# Altium schematic sheet axel_v1.schdoc
size 429 x 307 mm; Symbol: Sheet-Symbol_A4; Device: Sheet-Symbol_A4; @Project Name: Project Name; @Page Count: 3; @Update Date: 2021.11.05; @Create Date: 2024-10-22; @Schematic Name: Schematic Name; @Page No: 1; @Page Name: P1; Company: EasyEDA.com; Reviewed: EasyEDA; Version: V0.1; Page Size: A4; Part Number: JLCPCB-002; Drawn: EasyEDA; @Board Name: Board1; @Create Time: 00:31:28; @Update Time: 00:23:30; Width: 1655; Height: 1170; Region Start: 1; X Region Count: 6; Y Region Count: 4; Blade Width: 10; Title Block Position: 3
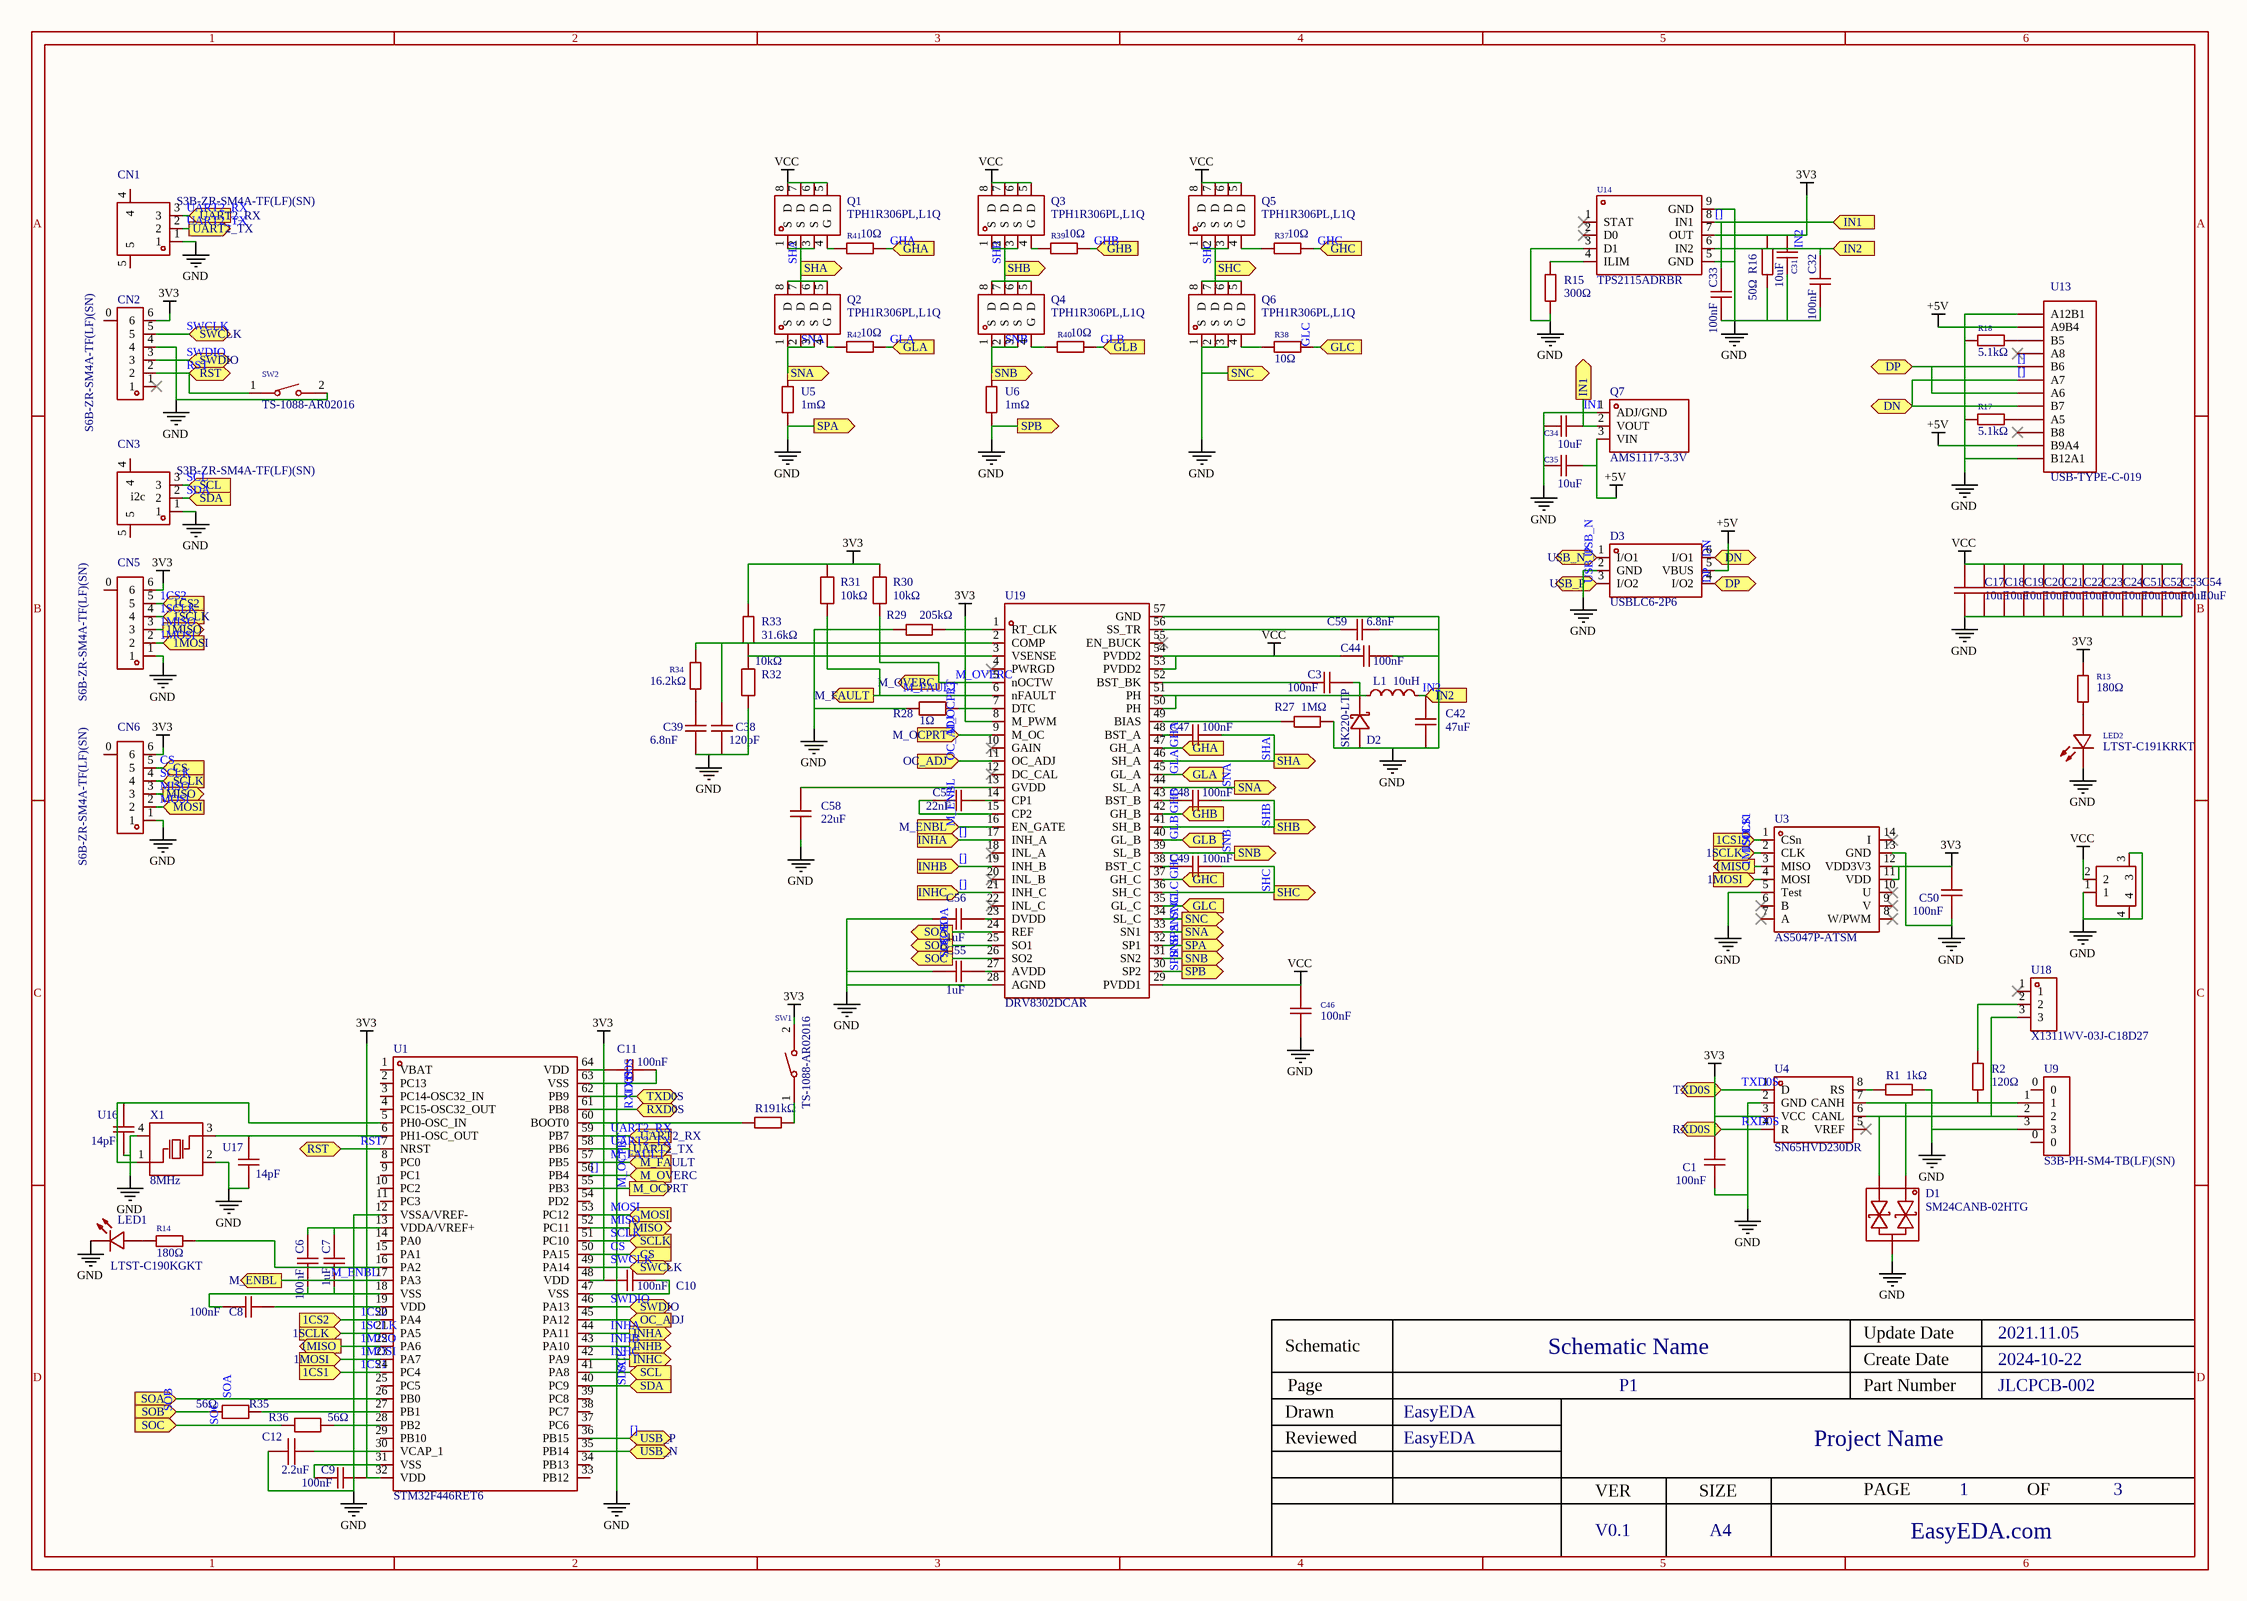
[diagram p0: axel_v1.schdoc]

## Parts
C1  100nF  [C0402]
C3  100nF  [C0402]
C6  100nF  [C0402]
C7  1uF  [C0402]
C8  100nF  [C0402]
C9  100nF  [C0402]
C10  100nF  [C0402]
C11  100nF  [C0402]
C12  2.2uF  [C0402]
C17  10uF  [C1210]
C18  10uF  [C1210]
C19  10uF  [C1210]
C20  10uF  [C1210]
C21  10uF  [C1210]
C22  10uF  [C1210]
C23  10uF  [C1210]
C24  10uF  [C1210]
C31  10uF  [C0402]
C32  100nF  [C0402]
C33  100nF  [C0402]
C34  10uF  [C0402]
C35  10uF  [C0402]
C38  120pF  [C0402]
C39  6.8nF  [C0402]
C42  47uF  [C1206]
C44  100nF  [C0603]
C46  100nF  [C0603]
C47  100nF  [C0402]
C48  100nF  [C0402]
C49  100nF  [C0402]
C50  100nF  [C0402]
C51  10uF  [C1210]
C52  10uF  [C1210]
C53  10uF  [C1210]
C54  10uF  [C1210]
C55  1uF  [C0402]
C56  1uF  [C0402]
C57  22nF  [C0402]
C58  22uF  [C0603]
C59  6.8nF  [C0402]
CN1  S3B-ZR-SM4A-TF(LF)(SN)  [CONN-TH_S3B-ZR-SM4A-TF-LF-SN]
CN2  S6B-ZR-SM4A-TF(LF)(SN)  [CONN-SMD_S6B-ZR-SM4A-TF]
CN3  S3B-ZR-SM4A-TF(LF)(SN)  [CONN-TH_S3B-ZR-SM4A-TF-LF-SN]
CN4  XT30PW-M  [CONN-TH_XT30PW-M]  (value not drawn)
CN5  S6B-ZR-SM4A-TF(LF)(SN)  [CONN-SMD_S6B-ZR-SM4A-TF]
CN6  S6B-ZR-SM4A-TF(LF)(SN)  [CONN-SMD_S6B-ZR-SM4A-TF]
D1  SM24CANB-02HTG  [SOT-23-3_L2.9-W1.3-P1.90-LS2.4-BR]
D2  SK220-LTP  [SMB_L4.6-W3.6-LS5.3-R-RD]
D3  USBLC6-2P6  [SOT-666-6_L1.6-W1.2-P0.50-LS1.6-BL]
L1  10uH  [IND-SMD_L5.2-W5.2_MCW-0530]
LED1  LTST-C190KGKT  [LED0603-RD]
LED2  LTST-C191KRKT  [LED0603-RD]
Q1  TPH1R306PL,L1Q  [POWERVDFN-8_L5.0-W5.0-P1.27-LS6.0-BL]
Q2  TPH1R306PL,L1Q  [POWERVDFN-8_L5.0-W5.0-P1.27-LS6.0-BL]
Q3  TPH1R306PL,L1Q  [POWERVDFN-8_L5.0-W5.0-P1.27-LS6.0-BL]
Q4  TPH1R306PL,L1Q  [POWERVDFN-8_L5.0-W5.0-P1.27-LS6.0-BL]
Q5  TPH1R306PL,L1Q  [POWERVDFN-8_L5.0-W5.0-P1.27-LS6.0-BL]
Q6  TPH1R306PL,L1Q  [POWERVDFN-8_L5.0-W5.0-P1.27-LS6.0-BL]
Q7  AMS1117-3.3V  [SOT-89-3_L4.5-W2.5-P1.50-LS4.2-BR]
R1  1kΩ  [R0402]
R2  120Ω  [R0402]
R13  180Ω  [R0402]
R14  180Ω  [R0402]
R15  300Ω  [R0402]
R16  50Ω  [R0402]
R17  5.1kΩ  [R0402]
R18  5.1kΩ  [R0402]
R19  1kΩ  [R0402]
R27  1MΩ  [R0402]
R28  1Ω  [R0402]
R29  205kΩ  [R0402]
R30  10kΩ  [R0402]
R31  10kΩ  [R0402]
R32  10kΩ  [R0402]
R33  31.6kΩ  [R0402]
R34  16.2kΩ  [R0402]
R35  56Ω  [R0402]
R36  56Ω  [R0402]
R37  10Ω  [R0402]
R38  10Ω  [R0402]
R39  10Ω  [R0402]
R40  10Ω  [R0402]
R41  10Ω  [R0402]
R42  10Ω  [R0402]
SW1  TS-1088-AR02016  [SW-SMD_L3.9-W3.0-P4.45]
SW2  TS-1088-AR02016  [SW-SMD_L3.9-W3.0-P4.45]
U1  STM32F446RET6  [LQFP-64_L10.0-W10.0-P0.50-LS12.0-BL]
U3  AS5047P-ATSM  [TSSOP-14_L5.0-W4.4-P0.65-LS6.4-BL]
U4  SN65HVD230DR  [SOIC-8_L4.9-W3.9-P1.27-LS6.0-BL]
U5  1mΩ  [R1210]
U6  1mΩ  [R1210]
U9  S3B-PH-SM4-TB(LF)(SN)  [CONN-SMD_S3B-PH-SM4-TB-LF-SN]
U13  USB-TYPE-C-019  [TYPE-C-SMD_HX-TYPE-C-16PIN]
U14  TPS2115ADRBR  [SON-8_L3.0-W3.0-P0.65-LS3.0-BL-EP]
U16  14pF  [C0402]
U17  14pF  [C0402]
U18  X1311WV-03J-C18D27  [HDR-TH_3P-P1.27-V-M]
U19  DRV8302DCAR  [HTSSOP-56_L14.0-W6.1-P0.50-LS8.1-BL-EP]
X1  8MHz  [OSC-SMD_4P-L3.2-W2.5-BL]

## Ports
1CS1 (in), 1CS2 (in), 1MISO (out), 1MOSI (in), 1SCLK (in), CS (in), DN (bidir), DP (bidir), GHA (in), GHB (in), GHC (in), GLA (in), GLB (in), GLC (in), IN1 (in), IN1 (out), IN2 (in), INHA (in), INHA (out), INHB (in), INHB (out), INHC (in), INHC (out), M_ENBL (in), M_ENBL (out), M_FAULT (in), M_FAULT (out), M_OCPRT (in), M_OCPRT (out), M_OVERC (in), M_OVERC (out), MISO (out), MOSI (in), OC_ADJ (in), RST (bidir), RXD0S (bidir), SCL (in), SCLK (in), SDA (in), SHA (out), SHB (out), SHC (out), SNA (out), SNB (out), SNC (out), SOA (in), SOA (out), SOB (in), SOB (out), SOC (in), SOC (out), SPA (out), SPB (out), SWCLK (bidir), SWDIO (bidir), TXD0S (bidir), UART2_RX (in), UART2_TX (out), USB_N (bidir), USB_P (bidir)

## Nets
3V3: C1.1 C6.2 C7.2 C8.2 C9.1 C10.2 C11.2 C31.2 C50.1 CN2.6 CN5.6 CN6.6 R13.2 R16.1 R30.2 R31.2 R33.2 SW1.2 U1.13(VDDA/VREF+) U1.19(VDD) U1.32(VDD) U1.48(VDD) U1.64(VDD) U3.11(VDD) U3.12(VDD3V3) U4.3(VCC) U14.7(OUT) U19.8(M_PWM)
+5V: C35.2 D3.5(VBUS) Q7.3(VIN) U13.A9B4 U13.B9A4
[]: C1.2 C6.1 C7.1 C8.1 C9.2 C10.1 C11.1 C12.1 C17.1 C18.1 C19.1 C20.1 C21.1 C22.1 C23.1 C24.1 C31.1 C32.1 C33.1 C33.2 C34.1 C34.2 C35.1 C38.2 C39.2 C42.1 C44.1 C46.2 C50.2 C51.1 C52.1 C53.1 C54.1 C55.1 C56.1 C58.2 C59.2 CN1.1 CN2.4 CN3.1 CN4.1 CN4.3 CN4.4 CN5.1 CN6.1 D1.3 D2.1(A) D3.2(GND) D3.3(I/O2) D3.4(I/O2) D3.6(I/O1) LED1.1(-) LED2.1(-) Q6.1(S) Q6.2(S) Q6.3(S) Q7.1(ADJ/GND) Q7.2(VOUT) R1.1 R15.1 R16.2 R17.1 R18.1 R27.2 R28.1 R29.1 R30.1 R32.1 SW2.2 U1.12(VSSA/VREF-) U1.18(VSS) U1.31(VSS) U1.36(PB15) U1.42(PA9) U1.43(PA10) U1.44(PA11) U1.47(VSS) U1.56(PB4) U1.63(VSS) U3.5(Test) U3.13(GND) U4.2(GND) U5.1 U6.1 U9.3 U13.A6 U13.A7 U13.A12B1 U13.B6 U13.B7 U13.B12A1 U14.3(D1) U14.5(GND) U14.8(IN1) U14.9(GND) U16.2 U17.2 U19.5(nOCTW) U19.17(INH_A) U19.19(INH_B) U19.21(INH_C) U19.28(AGND) U19.30(SP2) U19.32(SP1) U19.34(SL_C) U19.57(GND) X1.2(GND) X1.4(GND) ; port IN1, port DP, port DN, port USB_P, port INHA, port INHB, port INHC, port M_OVERC, port SPA, port SPB, port SNC  [also labelled DN, DP, GND, IN1, INHA, INHB, INHC, M_OVERC, SNC, SPA, SPB, USB_P]
VCC: C17.2 C18.2 C19.2 C20.2 C21.2 C22.2 C23.2 C24.2 C44.2 C46.1 C51.2 C52.2 C53.2 C54.2 CN4.2 Q1.5(D) Q1.6(D) Q1.7(D) Q1.8(D) Q3.5(D) Q3.6(D) Q3.7(D) Q3.8(D) Q5.5(D) Q5.6(D) Q5.7(D) Q5.8(D) U19.29(PVDD1) U19.53(PVDD2) U19.54(PVDD2)
1CS1: U1.24(PC4) U3.1(CSn) ; port 1CS1
1CS2: CN5.5 U1.20(PA4) ; port 1CS2
1MISO: CN5.3 U1.22(PA6) U3.3(MISO) ; port 1MISO
1MOSI: CN5.2 U1.23(PA7) U3.4(MOSI) ; port 1MOSI
1SCLK: CN5.4 U1.21(PA5) U3.2(CLK) ; port 1SCLK
CS: CN6.5 U1.50(PA15) ; port CS
GHA: R41.2 U19.47(GH_A) ; port GHA
GHB: R39.2 U19.42(GH_B) ; port GHB
GHC: R37.2 U19.37(GH_C) ; port GHC
GLA: R42.2 U19.45(GL_A) ; port GLA
GLB: R40.2 U19.40(GL_B) ; port GLB
GLC: R38.2 U19.35(GL_C) ; port GLC
IN2: C32.2 C42.2 L1.2 U14.6(IN2) ; port IN2
M_ENBL: U1.17(PA3) U19.16(EN_GATE) ; port M_ENBL
M_FAULT: R31.1 U1.57(PB5) U19.6(nFAULT) ; port M_FAULT
M_OCPRT: U1.55(PB3) U19.9(M_OC) ; port M_OCPRT
MISO: CN6.3 U1.52(PC11) ; port MISO
MOSI: CN6.2 U1.53(PC12) ; port MOSI
OC_ADJ: U1.45(PA12) U19.11(OC_ADJ) ; port OC_ADJ
RST: CN2.2 SW2.1 U1.7(NRST) ; port RST
RXD0S: U1.61(PB8) U4.4(R) ; port RXD0S
SCL: CN3.3 U1.41(PA8) ; port SCL
SCLK: CN6.4 U1.51(PC10) ; port SCLK
SDA: CN3.2 U1.40(PC9) ; port SDA
SHA: C47.1 Q1.1(S) Q1.2(S) Q1.3(S) Q2.5(D) Q2.6(D) Q2.7(D) Q2.8(D) U19.46(SH_A) ; port SHA
SHB: C48.1 Q3.1(S) Q3.2(S) Q3.3(S) Q4.5(D) Q4.6(D) Q4.7(D) Q4.8(D) U19.41(SH_B) ; port SHB
SHC: C49.1 Q5.1(S) Q5.2(S) Q5.3(S) Q6.5(D) Q6.6(D) Q6.7(D) Q6.8(D) U19.36(SH_C) ; port SHC
SNA: Q2.1(S) Q2.2(S) Q2.3(S) U5.2 U19.33(SN1) U19.44(SL_A) ; port SNA
SNB: Q4.1(S) Q4.2(S) Q4.3(S) U6.2 U19.31(SN2) U19.39(SL_B) ; port SNB
SOA: U1.26(PB0) U19.24(REF) ; port SOA
SOB: R35.1 U19.25(SO1) ; port SOB
SOC: R36.1 U19.26(SO2) ; port SOC
SWCLK: CN2.5 U1.49(PA14) ; port SWCLK
SWDIO: CN2.3 U1.46(PA13) ; port SWDIO
TXD0S: U1.62(PB9) U4.1(D) ; port TXD0S
UART2_RX: CN1.3 U1.59(PB7) ; port UART2_RX
UART2_TX: CN1.2 U1.58(PB6) ; port UART2_TX
USB_N: D3.1(I/O1) U1.35(PB14) ; port USB_N
NetC3_1: C3.1 U19.52(BST_BK)
NetC3_2: C3.2 D2.2(K) L1.1 U19.50(PH) U19.51(PH)
NetC12_2: C12.2 U1.30(VCAP_1)
NetC38_1: C38.1 R34.2 U19.2(COMP)
NetC39_1: C39.1 R34.1
NetC47_2: C47.2 U19.48(BST_A)
NetC48_2: C48.2 U19.43(BST_B)
NetC49_2: C49.2 U19.38(BST_C)
NetC55_2: C55.2 U19.27(AVDD)
NetC56_2: C56.2 U19.23(DVDD)
NetC57_1: C57.1 U19.14(CP1)
NetC57_2: C57.2 U19.15(CP2)
NetC58_1: C58.1 U19.13(GVDD)
NetC59_1: C59.1 U19.56(SS_TR)
NetD1_1: D1.1 R2.2 U4.7(CANH) U9.1
NetD1_2: D1.2 U4.6(CANL) U9.2 U18.3
NetLED1_2: LED1.2(+) R14.1
NetLED2_2: LED2.2(+) R13.1
NetQ1_4: Q1.4(G) R41.1
NetQ2_4: Q2.4(G) R42.1
NetQ3_4: Q3.4(G) R39.1
NetQ4_4: Q4.4(G) R40.1
NetQ5_4: Q5.4(G) R37.1
NetQ6_4: Q6.4(G) R38.1
NetR1_2: R1.2 U4.8(RS)
NetR2_1: R2.1 U18.2
NetR14_2: R14.2 U1.16(PA2)
NetR15_2: R15.2 U14.4(ILIM)
NetR17_2: R17.2 U13.A5
NetR18_2: R18.2 U13.B5
NetR19_1: R19.1 SW1.1
NetR19_2: R19.2 U1.60(BOOT0)
NetR27_1: R27.1 U19.49(BIAS)
NetR28_2: R28.2 U19.7(DTC)
NetR29_2: R29.2 U19.1(RT_CLK)
NetR32_2: R32.2 R33.1 U19.3(VSENSE)
NetR35_2: R35.2 U1.27(PB1)
NetR36_2: R36.2 U1.28(PB2)
NetU1_5: U1.5(PH0-OSC_IN) U16.1 X1.1(OSC1)
NetU1_6: U1.6(PH1-OSC_OUT) U17.1 X1.3(OSC2)

Not connected (* = marked no-connect by the designer): CN1 4 5; CN2 0 1*; CN3 4 5; CN5 0; CN6 0; U1 1(VBAT) 2(PC13) 3(PC14-OSC32_IN) 4(PC15-OSC32_OUT) 8(PC0) 9(PC1) 10(PC2) 11(PC3) 14(PA0) 15(PA1) 25(PC5) 29(PB10) 33(PB12) 34(PB13) 37(PC6) 38(PC7) 39(PC8) 54(PD2); U3 6(B)* 7(A)* 8(W/PWM)* 9(V)* 10(U)* 14(I)*; U4 5(VREF)*; U9 0; U13 A8* B8*; U14 1(STAT)* 2(D0)*; U18 1*; U19 4(PWRGD)* 10(GAIN)* 12(DC_CAL)* 18(INL_A)* 20(INL_B)* 22(INL_C)* 55(EN_BUCK)*

## Notes on the sheet
- (near CN3) i2c
- 1
- 2
- 3
- 4
- 5
- 6
- A
- B
- C
- Schematic
- Schematic Name
- Create Date
- Update Date
- 2021.11.05
- 2024-10-22
- D
- Drawn
- Page
- EasyEDA
- P1
- Part Number
- JLCPCB-002
- Reviewed
- VER
- SIZE
- PAGE
- Project Name
- OF
- V0.1
- A4
- EasyEDA.com

## Library data of the parts
C1 C3 C6 C8-C11 C32 C33 C47-C50 = 0402B104K250NT: Manufacturer: FH(风华); Symbol: CAP; Add into BOM: yes; Tolerance: ±10%; Check: true; Device: 0402B104K250NT; LCSC Part Name: 100nF ±10% 25V; Supplier Part: C56392; Manufacturer Part: 0402B104K250NT; Supplier Footprint: 0402; JLCPCB Part Class: Extended Part; Datasheet: https://atta.szlcsc.com/upload/public/pdf/source/20200305/C486355_26A10D38EF8C2A5C37091D0039909270.pdf; Supplier: LCSC; Convert to PCB: yes; Value: 100nF
C7 = TCC0402X5R105K160AT: Manufacturer: CCTC(三环); Symbol: TCC0402X5R105M6R3AT; Add into BOM: yes; Tolerance: ±10%; Check: true; Device: TCC0402X5R105K160AT; LCSC Part Name: 1uF ±10% 16V; Supplier Part: C5142580; Manufacturer Part: TCC0402X5R105K160AT; Supplier Footprint: 0402; JLCPCB Part Class: Extended Part; Datasheet: https://atta.szlcsc.com/upload/public/pdf/source/20220901/C7FE60C0D46A5253B97B3A98D5175D30.pdf; Supplier: LCSC; Convert to PCB: yes; Value: 1uF
C12 = CL05A225MQ5NSNC: Manufacturer: SAMSUNG(三星); Add into BOM: yes; Tolerance: ±20%; Check: true; Symbol: CL05A225MQ5NSNC; Device: CL05A225MQ5NSNC; LCSC Part Name: 2.2uF ±20% 6.3V; Supplier Part: C12530; Manufacturer Part: CL05A225MQ5NSNC; Supplier Footprint: 0402; JLCPCB Part Class: Basic Part; Datasheet: https://atta.szlcsc.com/upload/public/pdf/source/20160218/1457707763339.pdf; Supplier: LCSC; Convert to PCB: yes; Value: 2.2uF
C17-C24 C51-C54 = GRM32EC72A106KE05L: Manufacturer: muRata(村田); Add into BOM: yes; Tolerance: ±10%; Check: true; Symbol: GRM32EC72A106KE05L; Device: GRM32EC72A106KE05L; LCSC Part Name: 10uF ±10% 100V; Supplier Part: C576517; Manufacturer Part: GRM32EC72A106KE05L; Supplier Footprint: 1210; JLCPCB Part Class: Extended Part; Datasheet: https://atta.szlcsc.com/upload/public/pdf/source/20200716/C162505_CE68ED646330179BB59D1BEC6A5D09D7.pdf; Supplier: LCSC; Convert to PCB: yes; Value: 10uF
C31 C34 C35 = CL05A106MQ5NUNC: Manufacturer: SAMSUNG(三星); Add into BOM: yes; Tolerance: ±20%; Check: true; Symbol: CL05A106MQ5NUNC; Device: CL05A106MQ5NUNC; Supplier: LCSC; Manufacturer Part: CL05A106MQ5NUNC; Value: 10uF; Supplier Part: C15525; JLCPCB Part Class: Basic Part; LCSC Part Name: 10uF ±20% 6.3V; Supplier Footprint: 0402; Datasheet: https://atta.szlcsc.com/upload/public/pdf/source/20220823/2B02EE04F8F211D38A52DCB16EB6BEBA.pdf; Convert to PCB: yes
C38 = CC0402JRNPO9BN121: Manufacturer: YAGEO(国巨); Symbol: CAP; Add into BOM: yes; Tolerance: ±5%; Check: true; Device: CC0402JRNPO9BN121; LCSC Part Name: 120pF ±5% 50V; Supplier Part: C106996; Manufacturer Part: CC0402JRNPO9BN121; Supplier Footprint: 0402; JLCPCB Part Class: Extended Part; Datasheet: https://atta.szlcsc.com/upload/public/pdf/source/20170914/C128857_1505359892143968080.pdf; Supplier: LCSC; Convert to PCB: yes; Value: 120pF
C39 = CC0402KRX7R9BB682: Manufacturer: YAGEO(国巨); Symbol: CAP; Add into BOM: yes; Tolerance: ±10%; Check: true; Device: CC0402KRX7R9BB682; LCSC Part Name: 6.8nF ±10% 50V; Supplier Part: C93654; Manufacturer Part: CC0402KRX7R9BB682; Supplier Footprint: 0402; JLCPCB Part Class: Extended Part; Datasheet: https://atta.szlcsc.com/upload/public/pdf/source/20181008/C309510_22F155564471FAF6A489F7D68F34234E.pdf; Supplier: LCSC; Convert to PCB: yes; Value: 6.8nF
C42 = GRM31CR61A476ME15L: Manufacturer: muRata(村田); Add into BOM: yes; Tolerance: ±20%; Symbol: GRM31CR61A476ME15L; Device: GRM31CR61A476ME15L; LCSC Part Name: 47uF ±20% 10V; Supplier Part: C94034; Manufacturer Part: GRM31CR61A476ME15L; Supplier Footprint: 1206; JLCPCB Part Class: Extended Part; Datasheet: https://atta.szlcsc.com/upload/public/pdf/source/20170310/1489116302849.pdf; Supplier: LCSC; Convert to PCB: yes; Value: 47uF
C44 C46 = TCC0603X7R104K101CT: Manufacturer: CCTC(三环); Add into BOM: yes; Tolerance: ±10%; Symbol: TCC0603X7R104K101CT; Device: TCC0603X7R104K101CT; Supplier: LCSC; Supplier Part: C696916; Manufacturer Part: TCC0603X7R104K101CT; Value: 100nF; JLCPCB Part Class: Extended Part; LCSC Part Name: 100nF ±10% 100V; Supplier Footprint: 0603; Datasheet: https://atta.szlcsc.com/upload/public/pdf/source/20200707/C696841_89A2C111301AB76AE7642008585E7A11.pdf; Convert to PCB: yes
C55 C56 = TCC0402X5R105K160AT: Manufacturer: CCTC(三环); Add into BOM: yes; Tolerance: ±10%; Symbol: TCC0402X5R105K160AT; Device: TCC0402X5R105K160AT; LCSC Part Name: 1uF ±10% 16V; Supplier Part: C5142580; Manufacturer Part: TCC0402X5R105K160AT; Supplier Footprint: 0402; JLCPCB Part Class: Extended Part; Datasheet: https://atta.szlcsc.com/upload/public/pdf/source/20220901/C7FE60C0D46A5253B97B3A98D5175D30.pdf; Supplier: LCSC; Convert to PCB: yes; Value: 1uF
C57 = TCC0402X7R223K500AT: Manufacturer: CCTC(三环); Add into BOM: yes; Tolerance: ±10%; Symbol: TCC0402X7R223K500AT; Device: TCC0402X7R223K500AT; LCSC Part Name: 22nF ±10% 50V; Supplier Part: C380305; Manufacturer Part: TCC0402X7R223K500AT; Supplier Footprint: 0402; JLCPCB Part Class: Extended Part; Datasheet: https://atta.szlcsc.com/upload/public/pdf/source/20191203/C466239_F62A586702D44EEA1C39B32FC8662B21.pdf; Supplier: LCSC; Convert to PCB: yes; Value: 22nF
C58 = CL10A226MO7JZNC: Manufacturer: SAMSUNG(三星); Add into BOM: yes; Tolerance: ±20%; Symbol: CL10A226MO7JZNC; Device: CL10A226MO7JZNC; LCSC Part Name: 22uF ±20% 16V; Supplier Part: C2762594; Manufacturer Part: CL10A226MO7JZNC; Supplier Footprint: 0603; JLCPCB Part Class: Extended Part; Datasheet: https://atta.szlcsc.com/upload/public/pdf/source/20220811/0832C3B1C642040B023B7A6186895861.pdf; Supplier: LCSC; Convert to PCB: yes; Value: 22uF
C59 = CC0402KRX7R9BB682: Manufacturer: YAGEO(国巨); Symbol: 0402B682K500NT; Add into BOM: yes; Tolerance: ±10%; Device: CC0402KRX7R9BB682; LCSC Part Name: 6.8nF ±10% 50V; Supplier Part: C93654; Manufacturer Part: CC0402KRX7R9BB682; Supplier Footprint: 0402; JLCPCB Part Class: Extended Part; Datasheet: https://atta.szlcsc.com/upload/public/pdf/source/20181008/C309510_22F155564471FAF6A489F7D68F34234E.pdf; Supplier: LCSC; Convert to PCB: yes; Value: 6.8nF
CN1 CN3 = S3B-ZR-SM4A-TF(LF)(SN): Manufacturer: JST; Add into BOM: yes; Pins Structure: 1x3P; Pitch: 1.5mm; Reference Series: ZH; Number of PINs Per Row: 3; Current Rating (Max): 1A; Rated Voltage (Max): 50V; Plastic Material: PA6T; Flame Retardant Rating: UL94V-0; Supplementary Features: 辅助焊脚; Z-Height of the Board: 3.7mm; X-Length of Bottom Edge on Board (Spacing Line): 7.5mm; Y-Width of Bottom Edge on Board: 6.5mm; Check: true; Symbol: S3B-ZR-SM4A-TF(LF)(SN); Device: S3B-ZR-SM4A-TF(LF)(SN); LCSC Part Name: 1x3P 间距:1.5mm 卧贴 系列:ZH; Supplier Part: C72591; Manufacturer Part: S3B-ZR-SM4A-TF(LF)(SN); Supplier Footprint: SMD,P=1.5mm,卧贴; JLCPCB Part Class: Extended Part; Datasheet: https://atta.szlcsc.com/upload/public/pdf/source/20181010/C265435_265A0E364DE7AFA8D888C9DA34FBB2A6.pdf; Supplier: LCSC; Convert to PCB: yes; Mounting Style: 卧贴; Number of Pins: 3P; Number of Rows: 1; Row Spacing: -; Contact Material: Brass; Contact Plating: Tin; Operating Temperature Range: -25℃~+85℃; Colour: White
CN2 CN5 CN6 = S6B-ZR-SM4A-TF(LF)(SN): Manufacturer: JST; Add into BOM: yes; Pins Structure: 1x6P; Pitch: 1.5mm; Reference Series: ZH; Number of PINs Per Row: 6; Current Rating (Max): 1A; Rated Voltage (Max): 50V; Plastic Material: PA6T; Flame Retardant Rating: UL94V-0; Supplementary Features: Auxiliary soldering legs; Z-Height of the Board: 3.7mm; X-Length of Bottom Edge on Board (Spacing Line): 12mm; Y-Width of Bottom Edge on Board: 6.5mm; Check: true; Symbol: S6B-ZR-SM4A-TF(LF)(SN); Device: S6B-ZR-SM4A-TF(LF)(SN); LCSC Part Name: 1x6P 间距:1.5mm 卧贴 系列:ZH; Supplier Part: C265070; Manufacturer Part: S6B-ZR-SM4A-TF(LF)(SN); Supplier Footprint: SMD,P=1.5mm,卧贴; JLCPCB Part Class: Extended Part; Datasheet: https://atta.szlcsc.com/upload/public/pdf/source/20181114/C265070_E4B41040DCBDC845CB582ECD7CD45308.pdf; Supplier: LCSC; Convert to PCB: yes; Mounting Style: Horizontal attachment; Number of Pins: 6P; Number of Rows: 1; Row Spacing: -; Contact Material: Brass; Contact Plating: Tin; Operating Temperature Range: -25℃~+85℃; Colour: White
CN4 = XT30PW-M: Manufacturer: AMASS(艾迈斯); Add into BOM: yes; Brand: 艾迈斯; RatedVoltage: DC 500V; InterfaceType: 公头; RatedCurrent: 15A; RecommendedWireGauge: 16/18/20AWG; contact resistance: 1.2mΩ; specifications: 2pin; Check: true; Symbol: XT30PW-M; Device: XT30PW-M; Supplier: LCSC; Supplier Part: C431092; Manufacturer Part: XT30PW-M; JLCPCB Part Class: Extended Part; LCSC Part Name: AMASS(艾迈斯)航模插头 卧式弯脚 XT30PW-M公头; Supplier Footprint: -; Datasheet: https://atta.szlcsc.com/upload/public/pdf/source/20220222/6A9F22F7850E25B33E1BE430ADF8560B.pdf; Convert to PCB: yes; Model: XT30PW-M; Power: -; Output: -; Input: -; Size: -; Interface: -; Type: 航模插头; Colour: -; MaximumCurrent: -; Type1: -; NumberOfUSBHoles: -; MetalMaterial: -; InsulationMaterial: -; FlameRetardantGrade: -; Belt length: -
D1 = SM24CANB-02HTG: Manufacturer: Littelfuse(美国力特); Add into BOM: yes; Reverse Stand-Off Voltage (Vrwm): 24V@Max; Maximum Clamping Voltage: 50V; Peak Pulse Current (Ipp)@10/1000us: 10A@8/20us; Peak Pulse Power Dissipation (Ppp)@10/1000us: 500W; Breakdown Voltage: 26.7V; Type: TVS; Check: true; Symbol: SM24CANB-02HTG; Device: SM24CANB-02HTG; LCSC Part Name: SM24CANB-02HTG; Supplier Part: C151237; Manufacturer Part: SM24CANB-02HTG; Supplier Footprint: SOT-23; JLCPCB Part Class: Extended Part; Datasheet: https://atta.szlcsc.com/upload/public/pdf/source/20171201/C151237_15121179073421156494.pdf; Supplier: LCSC; Convert to PCB: yes
D2 = SK220-LTP: Manufacturer: MCC(美微科); Add into BOM: yes; Forward Voltage (Vf@If): 900mV@2A; Reverse Voltage (Vr): 200V; Average Rectified Current (Io): 2A; Reverse Leakage Current (Ir): 10uA@200V; Check: true; Symbol: SK220-LTP; Device: SK220-LTP; LCSC Part Name: 电压:200V 电流:2A; Supplier Part: C725397; Manufacturer Part: SK220-LTP; Supplier Footprint: DO-214AA(SMB); JLCPCB Part Class: Extended Part; Datasheet: https://atta.szlcsc.com/upload/public/pdf/source/20200618/C669011_F1CEF0D3BD7CC1B5AE107AF481F299E1.pdf; Supplier: LCSC; Convert to PCB: yes; Diode Configuration: -
D3 = USBLC6-2P6: Manufacturer: TECH PUBLIC(台舟); Symbol: USBLC6-2P6_C2827693; Add into BOM: yes; polarity: Unidirectional; Reverse Stand-Off Voltage (Vrwm): 5V; Maximum Clamping Voltage: 14V; Peak Pulse Current (Ipp): 5.5A; Peak Pulse Power Dissipation (Ppp): 80W; Breakdown Voltage: 6V; Reverse Leakage Current (Ir): 80nA; Number of Lines: Dual channel; level of protection: IEC 61000-4-2; Type: ESD; Check: true; Device: USBLC6-2P6; LCSC Part Name: MSL=3; Supplier Part: C2827693; Manufacturer Part: USBLC6-2P6; Supplier Footprint: SOT-666-6; JLCPCB Part Class: Extended Part; Datasheet: https://atta.szlcsc.com/upload/public/pdf/source/20210810/36353A9194EA9F4E33F8AE18BE051AEA.pdf; Supplier: LCSC; Convert to PCB: yes; Operating Temperature: -55℃~+125℃
L1 = SMMS0530-100M: Manufacturer: SXN(顺翔诺); Add into BOM: yes; Tolerance: ±20%; Saturation Current (Isat): 3.5A; Type: 一体成型电感; Symbol: SMMS0530-100M; Device: SMMS0530-100M; Supplier: LCSC; Supplier Part: C181721; Manufacturer Part: SMMS0530-100M; Value: 10uH; JLCPCB Part Class: Extended Part; LCSC Part Name: 10uH ±20% 3.5A; Supplier Footprint: SMD; Datasheet: https://atta.szlcsc.com/upload/public/pdf/source/20210810/BBF24330FB2F5029F637830BA9C42C0D.pdf; Convert to PCB: yes
LED1 = LTST-C190KGKT: Manufacturer: LITEON(光宝); Add into BOM: yes; Emitted Color: Green-yellow; Forward Voltage (VF): 2V; Power Dissipation: 75mW; Forward Current: 20mA; Dominant Wavelength: 567.5nm~576.5nm; Peak Wavelength: 574nm; Lens Color: 无色透明透镜; Luminous Intensity: 35mcd; Viewing Angle: 130°; Check: true; Symbol: LTST-C190KGKT; Device: LTST-C190KGKT; LCSC Part Name: 普绿/黄绿; Supplier Part: C125094; Manufacturer Part: LTST-C190KGKT; Supplier Footprint: 0603; JLCPCB Part Class: Extended Part; Datasheet: https://atta.szlcsc.com/upload/public/pdf/source/20180129/C125094_15171883203831315957.pdf; Supplier: LCSC; Convert to PCB: yes; Diode Configuration: -; Color Temperature: -; Mounting Sytle: -; Operating Temperature: -30℃~+85℃
LED2 = LTST-C191KRKT: Manufacturer: LITEON(光宝); Add into BOM: yes; Emitted Color: Red; Forward Voltage (VF): 2V; Power Dissipation: 75mW; Forward Current: 20mA; Dominant Wavelength: 631nm; Peak Wavelength: 639nm; Lens Color: 无色透明透镜; Luminous Intensity: 54mcd; Viewing Angle: 130°; Check: true; Symbol: LTST-C191KRKT; Device: LTST-C191KRKT; Supplier: LCSC; Manufacturer Part: LTST-C191KRKT; Supplier Part: C125099; JLCPCB Part Class: Extended Part; LCSC Part Name: 红灯; Supplier Footprint: 0603; Datasheet: https://atta.szlcsc.com/upload/public/pdf/source/20180129/C125099_15171878294931315872.pdf; Convert to PCB: yes; Diode Configuration: -; Color Temperature: -; Mounting Sytle: -; Operating Temperature: -55℃~+85℃
Q1-Q6 = TPH1R306PL,L1Q: Manufacturer: TOSHIBA(东芝); Add into BOM: yes; Type: 1个NChannel; Drain Source Voltage (Vdss): 60V; Power Dissipation (Pd): ；; Drain Source On Resistance (RDS(on)@Vgs,Id): 1.34mΩ@50A,10V; Gate Threshold Voltage (Vgs(th)@Id): 2.5V@1mA; Total Gate Charge (Qg@Vgs): 91nC@10V; Input Capacitance (Ciss@Vds): 8.1nF@30V; Check: true; Symbol: TPH1R306PL,L1Q; Device: TPH1R306PL,L1Q; LCSC Part Name: 1个N沟道 耐压:60V 电流:100A; Supplier Part: C516182; Manufacturer Part: TPH1R306PL,L1Q; Supplier Footprint: SOP-8; JLCPCB Part Class: Extended Part; Datasheet: https://atta.szlcsc.com/upload/public/pdf/source/20200417/C516182_3FBE290F0BA589EB2B5C14910E09ED65.pdf; Supplier: LCSC; Convert to PCB: yes; Reverse Transfer Capacitance (Crss@Vds): -
Q7 = AMS1117-3.3V_C5120796: Manufacturer: MSKSEMI(美森科); Add into BOM: yes; Maximum Input Voltage: 18V; Output Voltage: 3.3V; MAX Output Current: 1A; Dropout Voltage: 1.4V@(1A); standby current: 12mA; Output Polarity: Positive electrode; Number of Outputs: 1; Symbol: AMS1117-3.3V_C5120796; Device: AMS1117-3.3V_C5120796; LCSC Part Name: 输入18V 输出3.3V 1A; Supplier Part: C5120796; Manufacturer Part: AMS1117-3.3V; Supplier Footprint: SOT-89; JLCPCB Part Class: Extended Part; Datasheet: https://atta.szlcsc.com/upload/public/pdf/source/20220727/5E62EAC46FFFF83337622C0FBE1B6BF8.pdf; Supplier: LCSC; Convert to PCB: yes; Operating Temperature: 0℃~+125℃
R1 R19 = RT0402BRD071KL: Manufacturer: YAGEO(国巨); Symbol: Res; Add into BOM: yes; Tolerance: ±0.1%; Temperature Coefficient: ±25ppm/℃; Check: true; Device: RT0402BRD071KL; LCSC Part Name: 薄膜电阻 1kΩ ±0.1% 62.5mW; Supplier Part: C852624; Manufacturer Part: RT0402BRD071KL; Supplier Footprint: 0402; JLCPCB Part Class: Extended Part; Datasheet: https://atta.szlcsc.com/upload/public/pdf/source/20210609/C852624_9EB141A274604F87C6BB037C8019D50A.pdf; Supplier: LCSC; Convert to PCB: yes; Type: Thin Film Resistor; Value: 1kΩ; Operating Temperature Range: -55℃~+155℃
R2 = RN73H1ETTP1200B25: Manufacturer: KOA; Symbol: Res; Add into BOM: yes; Tolerance: ±0.1%; Temperature Coefficient: ±25ppm/℃; Check: true; Device: RN73H1ETTP1200B25; LCSC Part Name: 金属膜电阻 120Ω ±0.1% 62.5mW; Supplier Part: C186115; Manufacturer Part: RN73H1ETTP1200B25; Supplier Footprint: 0402; JLCPCB Part Class: Extended Part; Datasheet: https://atta.szlcsc.com/upload/public/pdf/source/20180504/C186301_C27E1BE5F8243F699B52B606AD6FD604.pdf; Supplier: LCSC; Convert to PCB: yes; Type: Metal Film Resistors; Value: 120Ω; Operating Temperature Range: -55℃~+155℃
R13 R14 = 0402WGF1800TCE: Manufacturer: UNI-ROYAL(厚声); Add into BOM: yes; Tolerance: ±1%; Temperature Coefficient: ±100ppm/℃; Check: true; Symbol: 0402WGF1800TCE; Device: 0402WGF1800TCE; Supplier: LCSC; Manufacturer Part: 0402WGF1800TCE; Supplier Part: C38941; Value: 180Ω; JLCPCB Part Class: Extended Part; LCSC Part Name: 180Ω ±1% 62.5mW 厚膜电阻; Supplier Footprint: 0402; Datasheet: https://atta.szlcsc.com/upload/public/pdf/source/20200306/C422600_1E6D84923E4A46A82E41ADD87F860B5C.pdf; Convert to PCB: yes; Type: Thick Film Resistors; Operating Temperature Range: -55℃~+155℃
R15 = RC0402FR-07300RL: Manufacturer: YAGEO(国巨); Add into BOM: yes; Tolerance: ±1%; Temperature Coefficient: ±100ppm/℃; Check: true; Symbol: RC0402FR-07300RL; Device: RC0402FR-07300RL; LCSC Part Name: 厚膜电阻 300Ω ±1% 62.5mW; Supplier Part: C138010; Manufacturer Part: RC0402FR-07300RL; Supplier Footprint: 0402; JLCPCB Part Class: Extended Part; Datasheet: https://atta.szlcsc.com/upload/public/pdf/source/20181009/C309620_DA5935B6E1D48212CB7A533FE518B3C2.pdf; Supplier: LCSC; Convert to PCB: yes; Type: Thick Film Resistors; Value: 300Ω; Operating Temperature Range: -55℃~+155℃
R16 = RT0402BRE0750RL: Manufacturer: YAGEO(国巨); Add into BOM: yes; Tolerance: ±0.1%; Temperature Coefficient: ±50ppm/℃; Check: true; Symbol: RT0402BRE0750RL; Device: RT0402BRE0750RL; LCSC Part Name: 薄膜电阻 50Ω ±0.1% 62.5mW; Supplier Part: C853312; Manufacturer Part: RT0402BRE0750RL; Supplier Footprint: 0402; JLCPCB Part Class: Extended Part; Datasheet: https://atta.szlcsc.com/upload/public/pdf/source/20200610/C326738_5639A9F1B6EB6E4AE2197577D3456E7F.pdf; Supplier: LCSC; Convert to PCB: yes; Type: Thin Film Resistor; Value: 50Ω; Operating Temperature Range: -55℃~+155℃
R17 R18 = 0402WGF5101TCE: Manufacturer: UNI-ROYAL(厚声); Add into BOM: yes; Tolerance: ±1%; Temperature Coefficient: ±100ppm/℃; Check: true; Symbol: 0402WGF5101TCE; Device: 0402WGF5101TCE; Supplier: LCSC; Manufacturer Part: 0402WGF5101TCE; Supplier Part: C25905; Value: 5.1kΩ; JLCPCB Part Class: Basic Part; LCSC Part Name: 5.1kΩ ±1% 62.5mW 厚膜电阻; Supplier Footprint: 0402; Datasheet: https://atta.szlcsc.com/upload/public/pdf/source/20200306/C422600_1E6D84923E4A46A82E41ADD87F860B5C.pdf; Convert to PCB: yes; Type: Thick Film Resistors; Operating Temperature Range: -55℃~+155℃
R27 = CR0402FF1004G: Manufacturer: LIZ(丽智电子); Symbol: RTT02105JTH; Add into BOM: yes; Tolerance: ±1%; Temperature Coefficient: ±200ppm/℃; Device: CR0402FF1004G; Supplier: LCSC; Manufacturer Part: CR0402FF1004G; Supplier Part: C100198; Value: 1MΩ; JLCPCB Part Class: Extended Part; LCSC Part Name: 厚膜电阻 1MΩ ±1% 62.5mW; Supplier Footprint: 0402; Datasheet: https://atta.szlcsc.com/upload/public/pdf/source/20180403/C189438_6D658388CC7843F35BBC9018D03F0B8E.pdf; Convert to PCB: yes; Type: Thick Film Resistors; Operating Temperature Range: -55℃~+125℃
R28 = FRC0402F1R00TS: Manufacturer: FOJAN(富捷); Add into BOM: yes; Tolerance: ±1%; Temperature Coefficient: ±200ppm/℃; Symbol: FRC0402F1R00TS; Device: FRC0402F1R00TS; LCSC Part Name: 1Ω ±1% 62.5mW 厚膜电阻; Supplier Part: C2909329; Manufacturer Part: FRC0402F1R00TS; Supplier Footprint: 0402; JLCPCB Part Class: Extended Part; Datasheet: https://atta.szlcsc.com/upload/public/pdf/source/20211221/925EC7D7225764EE0046F22065062C87.pdf; Supplier: LCSC; Convert to PCB: yes; Type: Thick Film Resistors; Value: 1Ω; Operating Temperature Range: -55℃~+155℃
R29 = RC-02W2053FT: Manufacturer: FH(风华); Add into BOM: yes; Tolerance: ±1%; Temperature Coefficient: ±200ppm/℃; Symbol: RC-02W2053FT; Device: RC-02W2053FT; LCSC Part Name: 厚膜电阻 205kΩ ±1% 62.5mW; Supplier Part: C321366; Manufacturer Part: RC-02W2053FT; Supplier Footprint: 0402; JLCPCB Part Class: Extended Part; Datasheet: https://atta.szlcsc.com/upload/public/pdf/source/20190117/C304933_DE23167EE8A6EA4261B120B384E5FCE3.pdf; Supplier: LCSC; Convert to PCB: yes; Type: Thick Film Resistors; Value: 205kΩ; Operating Temperature Range: -55℃~+155℃
R30-R32 = SCR0402J10K: Manufacturer: VO(翔胜); Add into BOM: yes; Tolerance: ±5%; Symbol: SCR0402J10K; Device: SCR0402J10K; LCSC Part Name: 厚膜电阻 10kΩ ±5% 62.5mW; Supplier Part: C3017497; Manufacturer Part: SCR0402J10K; Supplier Footprint: 0402; JLCPCB Part Class: Extended Part; Datasheet: https://atta.szlcsc.com/upload/public/pdf/source/20220513/247AF9639BA21CF93567DC289CCC6A22.pdf; Supplier: LCSC; Convert to PCB: yes; Type: Thick Film Resistors; Value: 10kΩ; Operating Temperature Range: -55℃~+155℃
R33 = 0402WGF3162TCE: Manufacturer: UNI-ROYAL(厚声); Add into BOM: yes; Tolerance: ±1%; Temperature Coefficient: ±100ppm/℃; Symbol: 0402WGF3162TCE; Device: 0402WGF3162TCE; LCSC Part Name: 31.6kΩ ±1% 62.5mW 厚膜电阻; Supplier Part: C11463; Manufacturer Part: 0402WGF3162TCE; Supplier Footprint: 0402; JLCPCB Part Class: Extended Part; Datasheet: https://atta.szlcsc.com/upload/public/pdf/source/20200306/C422600_1E6D84923E4A46A82E41ADD87F860B5C.pdf; Supplier: LCSC; Convert to PCB: yes; Type: Thick Film Resistors; Value: 31.6kΩ; Operating Temperature Range: -55℃~+155℃
R34 = 0402WGF1622TCE: Manufacturer: UNI-ROYAL(厚声); Add into BOM: yes; Tolerance: ±1%; Temperature Coefficient: ±100ppm/℃; Symbol: 0402WGF1622TCE; Device: 0402WGF1622TCE; Supplier: LCSC; Manufacturer Part: 0402WGF1622TCE; Supplier Part: C27176; Value: 16.2kΩ; JLCPCB Part Class: Extended Part; LCSC Part Name: 16.2kΩ ±1% 62.5mW 厚膜电阻; Supplier Footprint: 0402; Datasheet: https://atta.szlcsc.com/upload/public/pdf/source/20200306/C422600_1E6D84923E4A46A82E41ADD87F860B5C.pdf; Convert to PCB: yes; Type: Thick Film Resistors; Operating Temperature Range: -55℃~+155℃
R35 R36 = FRC0402F56R0TS: Manufacturer: FOJAN(富捷); Add into BOM: yes; Tolerance: ±1%; Temperature Coefficient: ±100ppm/℃; Symbol: FRC0402F56R0TS; Device: FRC0402F56R0TS; LCSC Part Name: 56Ω ±1% 62.5mW 厚膜电阻; Supplier Part: C3013179; Manufacturer Part: FRC0402F56R0TS; Supplier Footprint: 0402; JLCPCB Part Class: Extended Part; Datasheet: https://atta.szlcsc.com/upload/public/pdf/source/20211221/925EC7D7225764EE0046F22065062C87.pdf; Supplier: LCSC; Convert to PCB: yes; Type: Thick Film Resistors; Value: 56Ω
R37-R42 = RTT02100JTH: Manufacturer: RALEC(旺诠); Add into BOM: yes; Tolerance: ±5%; Temperature Coefficient: ±100ppm/℃; Symbol: RTT02100JTH; Device: RTT02100JTH; Supplier: LCSC; Manufacturer Part: RTT02100JTH; Supplier Part: C102753; Value: 10Ω; JLCPCB Part Class: Extended Part; LCSC Part Name: 厚膜电阻 10Ω ±5% 62.5mW; Supplier Footprint: 0402; Datasheet: https://atta.szlcsc.com/upload/public/pdf/source/20191219/C158410_884373A5B7E1BC76BF57BC45A946C093.pdf; Convert to PCB: yes; Type: Thick Film Resistors; Operating Temperature Range: -55℃~+155℃
SW1 SW2 = TS-1088-AR02016: Manufacturer: XUNPU(讯普); Add into BOM: yes; Circuit: SPST; Actuator Style: Round Button; Operating Force: 160gf; Switch Length: 4mm; Switch Width: 3mm; Switch Height: 2mm; Strike Gundam: 不带; Contact Current: 50mA; Voltage Rating (DC): 12V; Insulation Resistance: 100MΩ; Actuator/Cap Color: Black; Pin Style: SMDSplicing; Mechanical Life: 10万次; Check: true; Symbol: TS-1088-AR02016; Device: TS-1088-AR02016; Supplier: LCSC; Supplier Part: C720477; Manufacturer Part: TS-1088-AR02016; JLCPCB Part Class: Extended Part; LCSC Part Name: 4*3*2mm 立贴 轻触开关; Supplier Footprint: SMD; Datasheet: https://atta.szlcsc.com/upload/public/pdf/source/20200810/C720475_60D09DD6C54279ADDB2DC25100F1CC11.pdf; Convert to PCB: yes; Mounting Style: Brick nogging; Operating Temperature: -30℃~+80℃
U1 = STM32F446RET6: Manufacturer: ST(意法半导体); Add into BOM: yes; CPU Core: ARM-M4; Program Storage Size: 512KB; RAM Size: 128KB; GPIO Ports Number: 50; Operating Voltage Range: 1.7V~3.6V; CPU Maximum Speed: 180MHz; Program Memory Type: FLASH; ADC (Bit): 12bit; Peripheral/Function: PWM；PWM；Low-Voltage Detection; Check: true; Symbol: STM32F446RET6; Device: STM32F446RET6; LCSC Part Name: 带DSP和FPU的高性能基础系列ARM Cortex-M4 MCU，具有512 KB Flash、180 MHz CPU、ART加速器和双QSPI MSL=3; Supplier Part: C69336; Manufacturer Part: STM32F446RET6; Supplier Footprint: LQFP-64(10x10); JLCPCB Part Class: Extended Part; Datasheet: https://atta.szlcsc.com/upload/public/pdf/source/20170518/1495086068896.pdf; Supplier: LCSC; Convert to PCB: yes; Operating Temperature Range: -40℃~+85℃; DAC (Bit): 12bit; PWM (Bit): -; Universal Serial Bus: Yes; Internal Comparator: -; communication protocol: -; Watchdog: Yes; Real-Time Clock: -; Infrared Data Association: Yes; Low-Voltage Detect: Yes; CCP Capture/Compare: -; Secure Digital Input and Output: -; Direct Memory Access: Yes; Internal Oscillator: Yes
U3 = AS5047P-ATSM_C962063: Manufacturer: ams(艾迈斯半导体); Add into BOM: yes; Symbol: AS5047P-ATSM_C962063; Device: AS5047P-ATSM_C962063; LCSC Part Name: AS5047P-ATSM; Supplier Part: C962063; Manufacturer Part: AS5047P-ATSM; Supplier Footprint: TSSOP-14; JLCPCB Part Class: Extended Part; Datasheet: https://atta.szlcsc.com/upload/public/pdf/source/20230424/95EDFD761CCFD379FE860E4B35935AF0.pdf; Supplier: LCSC; Convert to PCB: yes
U4 = SN65HVD230DR: Manufacturer: TI(德州仪器); Add into BOM: yes; Data Rate: 1Mbps; Supply Voltage: 3V~3.6V; Check: true; Symbol: SN65HVD230DR; Device: SN65HVD230DR; LCSC Part Name: 1Mbps 3V~3.6V; Supplier Part: C12084; Manufacturer Part: SN65HVD230DR; Supplier Footprint: SOIC-8; JLCPCB Part Class: Extended Part; Datasheet: https://www.ti.com/cn/lit/gpn/sn65hvd230; Supplier: LCSC; Convert to PCB: yes; Type: Transceiver; Operating Temperature: -40℃~+85℃
U5 U6 = PMR25HZPFV1L00: Manufacturer: ROHM(罗姆); Add into BOM: yes; Tolerance: ±1%; Temperature Coefficient: ±100ppm/℃; Check: true; Symbol: PMR25HZPFV1L00; Device: PMR25HZPFV1L00; LCSC Part Name: 1mΩ ±1% 1W; Supplier Part: C509735; Manufacturer Part: PMR25HZPFV1L00; Supplier Footprint: 1210; JLCPCB Part Class: Extended Part; Datasheet: https://atta.szlcsc.com/upload/public/pdf/source/20201028/C509732_00E602A5AC169EB7992E30A642CBB2A3.pdf; Supplier: LCSC; Convert to PCB: yes; Type: Current Sensing Resistors; Value: 1mΩ
U9 = S3B-PH-SM4-TB(LF)(SN): Manufacturer: JST; Add into BOM: yes; Pins Structure: 1x3P; Pitch: 2mm; Reference Series: PH; Number of PINs Per Row: 3; Current Rating (Max): 2A; Rated Voltage (Max): 100V; Plastic Material: PA; Flame Retardant Rating: UL94V-0; Supplementary Features: 辅助焊脚; Z-Height of the Board: 5.5mm; X-Length of Bottom Edge on Board (Spacing Line): 9.9mm; Y-Width of Bottom Edge on Board: 8.6mm; Check: true; Symbol: S3B-PH-SM4-TB(LF)(SN); Device: S3B-PH-SM4-TB(LF)(SN); LCSC Part Name: 1x3P 间距:2mm 卧贴 系列:PH; Supplier Part: C265101; Manufacturer Part: S3B-PH-SM4-TB(LF)(SN); Supplier Footprint: SMD,P=2mm,卧贴; JLCPCB Part Class: Extended Part; Datasheet: https://atta.szlcsc.com/upload/public/pdf/source/20181010/C265101_22107ACC4D8714694FDA2DD97145FA81.pdf; Supplier: LCSC; Convert to PCB: yes; Mounting Style: 卧贴; Number of Pins: 3P; Number of Rows: 1; Row Spacing: -; Contact Material: Copper Alloy; Contact Plating: Tin; Operating Temperature Range: -25℃~+85℃; Colour: 米色
U13 = USB-TYPE-C-019: Manufacturer: DEALON(德艺隆); Add into BOM: yes; Connector Type: Type-C; Gender: Female; Number of Contacts: 16P; Number of Ports: 1; Current Rating - Power (Max): 3A; Check: true; Symbol: USB-TYPE-C-019; Device: USB-TYPE-C-019; LCSC Part Name: Type-C 母 卧贴; Supplier Part: C2927039; Manufacturer Part: USB-TYPE-C-019; Supplier Footprint: SMD; JLCPCB Part Class: Extended Part; Datasheet: https://atta.szlcsc.com/upload/public/pdf/source/20240201/043F3FE3A082BDB311DB5CCB832E890E.pdf; Supplier: LCSC; Convert to PCB: yes; Standard: -; Mounting Style: Horizontal attachment; Operating Temperature Range: -25℃~+85℃
U14 = TPS2115ADRBR: Manufacturer: TI(德州仪器); Add into BOM: yes; Output Current: 2A; Input Voltage: 2.8V~5.5V; Check: true; Symbol: TPS2115ADRBR; Device: TPS2115ADRBR; Supplier: LCSC; Supplier Part: C140321; Manufacturer Part: TPS2115ADRBR; JLCPCB Part Class: Extended Part; LCSC Part Name: TPS2115ADRBR; Supplier Footprint: SON-8(3x3); Datasheet: https://www.ti.com/cn/lit/gpn/tps2115a; Convert to PCB: yes; Operating Temperature	-: -40℃~+85℃
U16 U17 = 0402CG140J500NT: Manufacturer: FH(风华); Add into BOM: yes; Tolerance: ±5%; Symbol: 0402CG140J500NT; Device: 0402CG140J500NT; LCSC Part Name: 14pF ±5% 50V; Supplier Part: C3037644; Manufacturer Part: 0402CG140J500NT; Supplier Footprint: 0402; JLCPCB Part Class: Extended Part; Datasheet: https://atta.szlcsc.com/upload/public/pdf/source/20200305/C486355_26A10D38EF8C2A5C37091D0039909270.pdf; Supplier: LCSC; Convert to PCB: yes; Value: 14pF
U18 = X1311WV-03J-C18D27: Manufacturer: XKB Connection(中国星坤); Add into BOM: yes; Pin Structure: 1x3P; Pitch: 1.27mm; Circluar Pins/Square Pins: Square Pins; Current Rating (Max): 1A; Voltage Rating (Max): 250V; Soldering Temperature(Max): 260℃; Symbol: X1311WV-03J-C18D27; Device: X1311WV-03J-C18D27; LCSC Part Name: 1x3P 间距:1.27mm 方针; Supplier Part: C2881648; Manufacturer Part: X1311WV-03J-C18D27; Supplier Footprint: 插件,P=1.27mm; JLCPCB Part Class: Extended Part; Datasheet: https://atta.szlcsc.com/upload/public/pdf/source/20211011/BDECBA1A8033BEEEAFBA4B601EFBF35E.pdf; Supplier: LCSC; Convert to PCB: yes; Row Spacing: 1.27mm; Mounting Type: -; Number of Rows: Plugin; Number of Pins: 3P; Length of Mating Pin: -; Insulation Height: 1mm; Length of End Connection Pin: -; Contact Plating: Gold; Operating Temperature Range: -40℃~+105℃; Color: Black
U19 = DRV8302DCAR: Manufacturer: TI(德州仪器); Add into BOM: yes; Symbol: DRV8302DCAR; Device: DRV8302DCAR; LCSC Part Name: 无刷直流BLDC电机驱动芯片 60V; Supplier Part: C79740; Manufacturer Part: DRV8302DCAR; Supplier Footprint: HTSSOP-56-6mm; JLCPCB Part Class: Extended Part; Datasheet: https://www.ti.com/cn/lit/gpn/drv8302; Supplier: LCSC; Convert to PCB: yes
X1 = TAXM8M4RFDCET2T: Manufacturer: YJX(雅晶鑫); Add into BOM: yes; Crystal Type: Surface Mount Crystal; Normal temperature Frequency Tolerance: ±20ppm; Equivalent Series Resistance (ESR): 250Ω; Symbol: TAXM8M4RFDCET2T; Device: TAXM8M4RFDCET2T; LCSC Part Name: 8MHz ±20ppm 12pF; Supplier Part: C403948; Manufacturer Part: TAXM8M4RFDCET2T; Supplier Footprint: SMD3225-4P; JLCPCB Part Class: Extended Part; Datasheet: https://atta.szlcsc.com/upload/public/pdf/source/20190712/C403948_DCE244DEF035C9ADCC7C08191B17B6F0.pdf; Supplier: LCSC; Convert to PCB: yes; Value: 8MHz; Frequency Stability(Full temperature range): ±20ppm